# Altium schematic sheet SmartCharger.SchDoc
size 420 x 297 mm; SheetNumber: 1; SheetTotal: 1
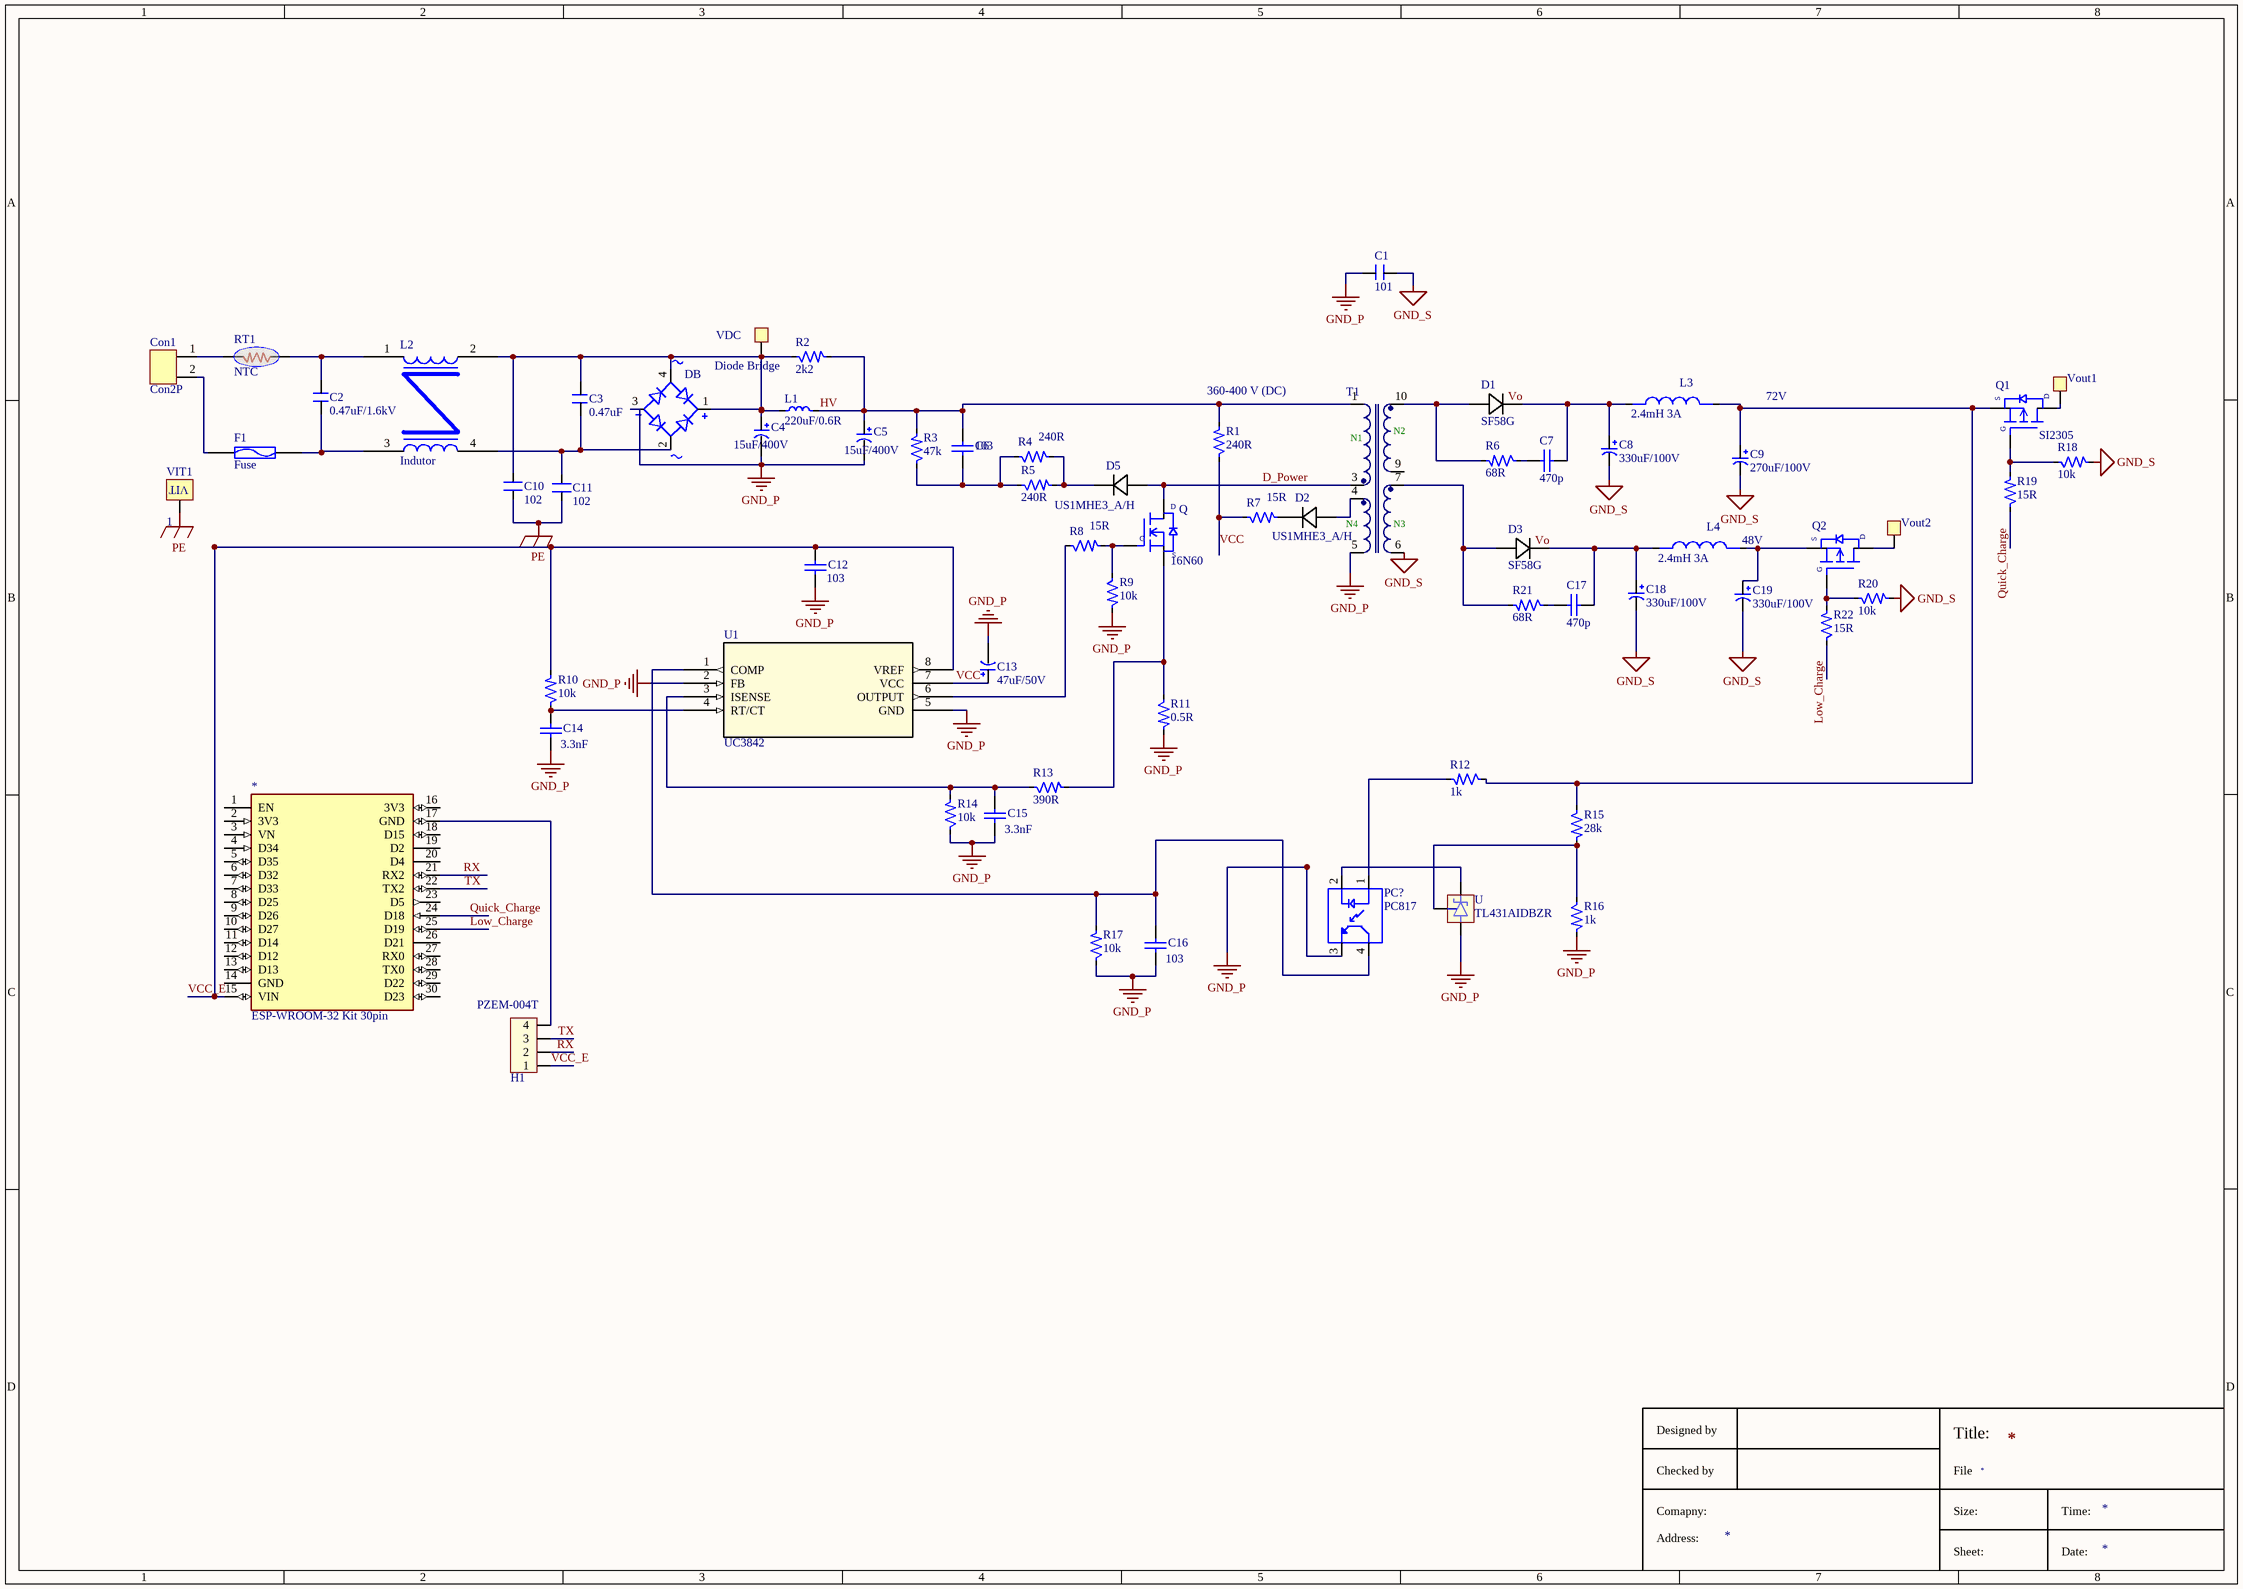
[diagram p0: SmartCharger.SchDoc]

## Parts
*  ESP-WROOM-32 Kit 30pin  [ESP-WROOM-32]
C1  101  [CN3]
C2  0.47uF/1.6kV  [Cap CBB]
C3  0.47uF  [Cap CBB]
C4  15uF/400V  [CAP 47uF 400V]
C5  15uF/400V  [CAP 47uF 400V]
C6  103  [CAP-SMD-0805]
C7  470p  [CAP-SMD-1206]
C8  330uF/100V  [CAP-ALU-SMD_B-4.0x5.4]
C9  270uF/100V  [CAP-ALU-SMD_B-4.0x5.4]
C10  102  [C-SE-7,5x10x9x5x4]
C11  102  [C-SE-7,5x10x9x5x4]
C12  103  [CAP-SMD-1206]
C13  47uF/50V  [CAP 47uF 400V]
C14  3.3nF  [CAP-SMD-1206]
C15  3.3nF  [CAP-SMD-1206]
C16  103  [CAP-SMD-1206]
C17  470p  [CAP-SMD-1206]
C18  330uF/100V  [CAP-ALU-SMD_B-4.0x5.4]
C19  330uF/100V  [CAP-ALU-SMD_B-4.0x5.4]
Con1  Con2P  [Con2 APES]
D1  SF58G  [DO-214AC]
D2  US1MHE3_A/H  [DO-214AC]
D3  SF58G  [DO-214AC]
D5  US1MHE3_A/H  [DO-214AC]
DB  Diode Bridge  [DIOB_MB10F-13]
F1  Fuse  [Fuse]
H1  PZEM-004T  [Header 4P 2.0mm]
L1  220uF/0.6R  [L-100uH 3A 8x10 DIP]
L2  Indutor  [Inductor UU9.8]
L3  2.4mH 3A  [IND_P220_D378_H452_70X59_TH]
L4  2.4mH 3A  [IND_P220_D378_H452_70X59_TH]
PC?  PC817  [SOIC254P1030X390-4N_EL817S1(C)(TA)-V]
Q  16N60  [QTO-220H2]
Q1  SI2305  [SOT-23]
Q2  (no value)  [SOT-23]
R1  240R  [RES-SMD-1206]
R2  2k2  [RES-SMD-0805]
R3  47k  [RES-SMD-1206]
R4  240R  [RES-SMD-1206]
R5  240R  [RES-SMD-1206]
R6  68R  [RES-SMD-0805]
R7  15R  [RES-SMD-1206]
R8  15R  [RES-SMD-1206]
R9  10k  [RES-SMD-1206]
R10  10k  [RES-SMD-0805]
R11  0.5R  [RES-SMD-1206]
R12  1k  [RES-SMD-0805]
R13  390R  [RES-SMD-1206]
R14  10k  [RES-SMD-0805]
R15  28k  [RES-SMD-0805]
R16  1k  [RES-SMD-0805]
R17  10k  [RES-SMD-0805]
R18  10k  [RES-SMD-1206]
R19  15R  [RES-SMD-1206]
R20  10k  [RES-SMD-1206]
R21  68R  [RES-SMD-0805]
R22  15R  [RES-SMD-1206]
RT1  NTC  [NTC7_5]
T1  360-400 V (DC)  [TRANSFORMER EE20]
U  TL431AIDBZR  [SOT-23]
U1  UC3842  [SOIC-8]
VDC  TEST POINT  [TEST POINT]  (value not drawn)
VIT1  1  [VIT]
Vout1  TEST POINT  [TEST POINT]  (value not drawn)
Vout2  TEST POINT  [TEST POINT]  (value not drawn)

## Nets
GND_P: C1.1 C4.2 C5.2 C12.1 C13.2 C14.1 C15.1 C16.1 DB.3(NEG) PC?.3(ET) R9.2 R11.2 R14.1 R16.2 R17.1 T1.5 U.3(ANODE) U1.2(FB) U1.5(GND)
GND_S: C1.2 C8.2 C9.2 C18.2 C19.2 R18.2 R20.2 T1.6
PE: C10.1 C11.1 VIT1.VIT1
D_Power: D5.2 Q.3(D) T1.3
HV: C5.1 C6.2 L1.2 R1.2 R2.2 R3.2 T1.1
Low_Charge: *.25(D19) R22.1
Quick_Charge: *.24(D18) R19.1
RX: *.21(RX2) H1.2
TX: *.22(TX2) H1.3
VCC: C13.1 R1.1 R7.1 U1.7(VCC)
VCC_E: *.15(VIN) C12.2 H1.1 R10.2 U1.8(VREF)
Net*_17: *.17(GND) H1.4
NetC2_1: C2.1 F1.2 L2.3
NetC2_2: C2.2 L2.1 RT1.2
NetC3_1: C3.1 C11.2 DB.2(AC1) L2.4
NetC3_2: C3.2 C4.1 C10.2 DB.1(POS) DB.4(AC2) L1.1 L2.2 R2.1
NetC6_1: C6.1 R3.1 R4.1 R5.1
NetC7_1: C7.1 R6.1
NetC7_2: C7.2 C8.1 D1.1 L3.1
NetC9_1: C9.1 L3.2 Q1.2(S) R12.1 R15.1
NetC14_2: C14.2 R10.1 U1.4(RT/CT)
NetC15_2: C15.2 R13.1 R14.2 U1.3(ISENSE)
NetC16_2: C16.2 PC?.4(CT) R17.2 U1.1(COMP)
NetC17_1: C17.1 R21.1
NetC17_2: C17.2 C18.1 D3.1 L4.1
NetC19_1: C19.1 L4.2 Q2.2(S)
NetCon1_1: Con1.1 RT1.1
NetCon1_2: Con1.2 F1.1
NetD1_2: D1.2 R6.2 T1.10
NetD2_1: D2.1 R7.2
NetD2_2: D2.2 T1.4
NetD3_2: D3.2 R21.2 T1.7
NetD5_1: D5.1 R4.2 R5.2
NetPC?_1: PC?.1(A) R12.2
NetPC?_2: PC?.2(C) U.2(CATHODE)
NetQ1_1: Q1.1(G) R18.1 R19.2
NetQ1_3: Q1.3(D) Vout1.1
NetQ2_1: Q2.1(G) R20.1 R22.2
NetQ2_3: Q2.3(D) Vout2.1
NetQ_1: Q.1(G) R8.2 R9.1
NetQ_2: Q.2(S) R11.1 R13.2
NetR8_1: R8.1 U1.6(OUTPUT)
NetR15_2: R15.2 R16.1 U.1(REF)

Not connected (* = marked no-connect by the designer): * 1(EN) 2(3V3) 3(VN) 4(D34) 5(D35) 6(D32) 7(D33) 8(D25) 9(D26) 10(D27) 11(D14) 12(D12) 13(D13) 14(GND) 16(3V3) 18(D15) 19(D2) 20(D4) 23(D5) 26(D21) 27(RX0) 28(TX0) 29(D22) 30(D23); T1 9; VDC 1

## Notes on the sheet
- 72V
- (near L4) 48V
- Labels drawn without touching a wire or pin: Vo
- Designed by
- Checked by
- Title:
- File
- Title
- Comapny:
- Address:
- Size:
- Time:
- Date:
- File:
- A1
- Number:
- Revision:
- Sheet
- of
- Sheet:
- (in symbol TRANSFORMER PULSE) N2; N1; N4; N3
- (in symbol VIT_1) VIT

## Library data of the parts
C1 C3 = Cap: 0.47uF/1.6kV
C2 = Cap
C4 C5 C13 = Cap_electric: cap
C6 C7 C12 C14-C17 = CAP SMD: Capacitor; Value: 33p; Published: 8-Jun-2000; LatestRevisionDate: 17-Jul-2002; LatestRevisionNote: Re-released for DXP Platform.; PackageReference: RAD-0.3; Publisher: Altium Limited
C8 C9 C18 C19 = Cap_smd: cap smd
C10 C11 = CN-SEMI-DIP: Capacitor (Semiconductor SIM Model); Value: 104; LatestRevisionDate: 17-Jul-2002; LatestRevisionNote: Re-released for DXP Platform.; PackageReference: C1206; Publisher: Altium Limited
Con1 = connector2P
D1-D3 D5 = Diode Rectifier: Surface-Mount Ultrafast Rectifier
H1 = Header 4P: Connector 2; Value: Connector 2
L1 = L DIP
L2 = Inductor UU9.8: UU9.8
L3 L4 = INDUCTOR DIP: MP: ASPI-0615FS-220M-T2; Availability: Unavailable; Package: None; Price: None; Value: *
PC? = Optoisoltr: Optoisoltr 5kv Transistor 4-Smd; MP: EL817S1(C)(TA)-V; Package: None; Price: None; Value: *; Availability: Unavailable
Q = MOSFET N-Chanel: N-Channel 600V 6A (Ta) 1.4W (Ta) Surface Mount SOT-23-3L; MF: Alpha & Omega Semiconductor; MP: AO3401; Price: None; SnapEDA_Link: https://www.snapeda.com/parts/AO3401/Alpha%20&%20Omega%20Semiconductor/view-part/4795619/?ref=snap; Arrow_Electronics-Purchase-URL: https://snapeda.com/shop?store=Arrow+Electronics&id=4795619; Availability: Warning; Value: *; Package: SOT-23-3 Alpha &amp; Omega Semiconductor
Q1 Q2 = MOSFET P-Chanel: P-Channel 200V 10A (Ta) 1.4W (Ta) Surface Mount SOT-23-3L; MF: Alpha & Omega Semiconductor; MP: AO3401; Price: None; SnapEDA_Link: https://www.snapeda.com/parts/AO3401/Alpha%20&%20Omega%20Semiconductor/view-part/4795619/?ref=snap; Arrow_Electronics-Purchase-URL: https://snapeda.com/shop?store=Arrow+Electronics&id=4795619; Availability: Warning; Value: *; Package: SOT-23-3 Alpha &amp; Omega Semiconductor
R1-R22 = RES SMD: Resistor SMD; Value: R1/4W - 1K
RT1 = RT
T1 = TRANSFORMER PULSE: Resonant Converter WE-LLCR, Ui=360-400 V (DC); PartNo: 760895441; Manufacturer: Würth Elektronik eiSos GmbH; OutPut Voltage: 24 V; Output Current: 6.2A; (Input Voltage) Ui: 360-400 V (DC); ComponentLink1Description: Manufacturer; ComponentLink1URL: http://www.we-online.de; Created by: Otto Christin; Created Date: NOV 2013; ComponentLink2Description: Datasheet; ComponentLink2URL: http://katalog.we-online.de/pbs/datasheet/760895441.pdf
U = TL431AIDBZR: Shunt Voltage Reference IC 36V Â±1% SOT-23-3; MF: Texas Instruments; Package: SOT-23-3 Nexperia; Value: *; Availability: Unavailable; MP: TL431AIDBZR; Price: None; SnapEDA_Link: https://www.snapeda.com/parts/TL431AIDBZR/Texas%20Instruments/view-part/2175246/?ref=snap
VIT1 = VIT_1: Oc Vit